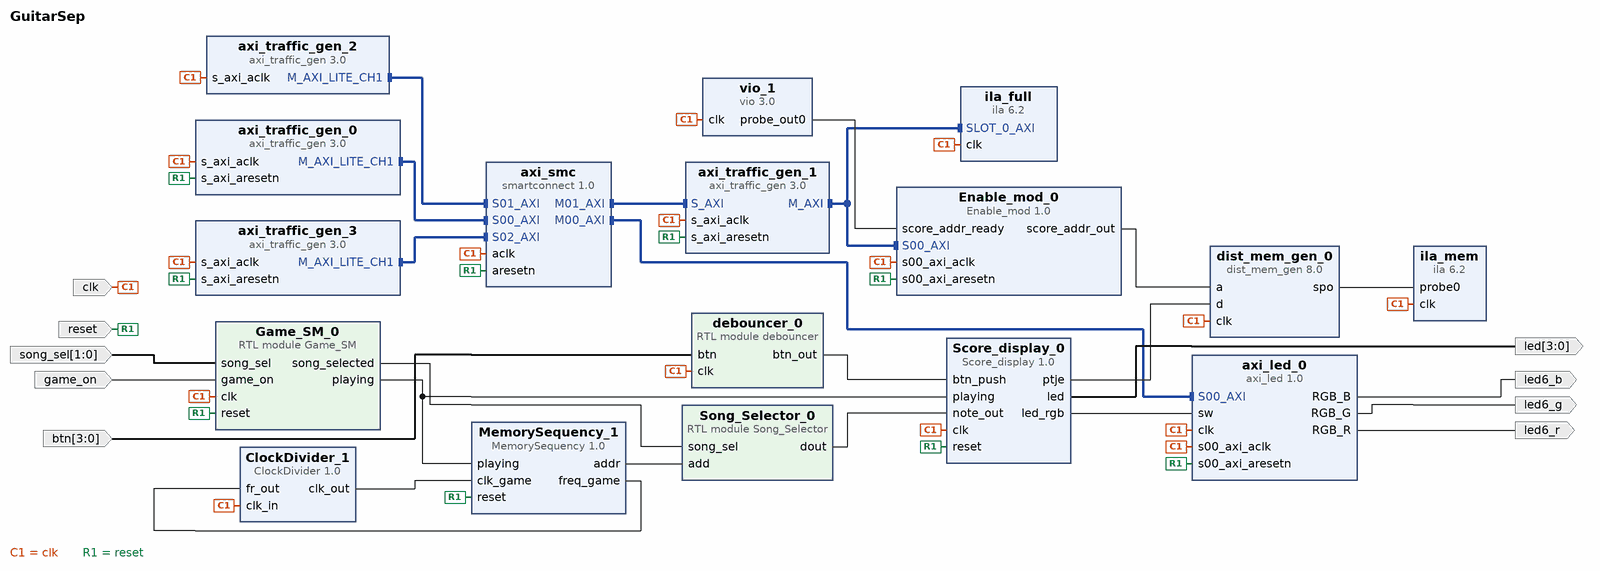
[diagram p0: block diagram of the top level]
# Vivado block design GuitarSep, xc7z010clg400-1, Vivado 2020.1
create_bd_design GuitarSep

create_bd_port -dir I -type clk clk
set_property -dict {CONFIG.ASSOCIATED_RESET reset:reset_0} [get_bd_ports clk]
create_bd_port -dir I -from 3 -to 0 btn
create_bd_port -dir I -from 1 -to 0 song_sel
create_bd_port -dir I -type rst reset
create_bd_port -dir O -from 3 -to 0 led
create_bd_port -dir O led6_b
create_bd_port -dir O led6_g
create_bd_port -dir O led6_r
create_bd_port -dir I game_on

create_bd_cell -type module -reference Game_SM Game_SM_0
create_bd_cell -type module -reference debouncer debouncer_0
create_bd_cell -type ip -vlnv xilinx.com:user:MemorySequency:1.0 MemorySequency_1
create_bd_cell -type ip -vlnv xilinx.com:user:ClockDivider:1.0 ClockDivider_1
create_bd_cell -type ip -vlnv xilinx.com:ip:axi_traffic_gen:3.0 axi_traffic_gen_0
set_property -dict [list \
  CONFIG.C_ATG_MODE AXI4-Lite \
  CONFIG.C_ATG_SYSINIT_MODES System_Test \
  CONFIG.C_ATG_SYSTEM_CMD_MAX_RETRY 2147483647 \
  CONFIG.C_ATG_SYSTEM_INIT_ADDR_MIF ../../../../../../../../../addr.coe \
  CONFIG.C_ATG_SYSTEM_INIT_CTRL_MIF ../../../../../../../../../ctrl.coe \
  CONFIG.C_ATG_SYSTEM_INIT_DATA_MIF ../../../../../../../../../data.coe \
  CONFIG.C_ATG_SYSTEM_INIT_MASK_MIF ../../../../../../../../../mask.coe \
] [get_bd_cells axi_traffic_gen_0]
create_bd_cell -type ip -vlnv xilinx.com:ip:smartconnect:1.0 axi_smc
set_property -dict {CONFIG.NUM_MI 2 CONFIG.NUM_SI 3} [get_bd_cells axi_smc]
create_bd_cell -type ip -vlnv xilinx.com:ip:axi_traffic_gen:3.0 axi_traffic_gen_2
set_property -dict [list \
  CONFIG.C_ATG_MODE AXI4-Lite \
  CONFIG.C_ATG_SYSINIT_MODES System_Test \
  CONFIG.C_ATG_SYSTEM_CMD_MAX_RETRY 2147483647 \
  CONFIG.C_ATG_SYSTEM_INIT_ADDR_MIF {../../../../../../../../../addr - copia.coe} \
  CONFIG.C_ATG_SYSTEM_INIT_CTRL_MIF {../../../../../../../../../ctrl - copia.coe} \
  CONFIG.C_ATG_SYSTEM_INIT_DATA_MIF {../../../../../../../../../data - copia.coe} \
  CONFIG.C_ATG_SYSTEM_INIT_MASK_MIF {../../../../../../../../../mask - copia.coe} \
] [get_bd_cells axi_traffic_gen_2]
create_bd_cell -type ip -vlnv xilinx.com:ip:axi_traffic_gen:3.0 axi_traffic_gen_1
set_property -dict {CONFIG.C_ATG_MODE AXI4} [get_bd_cells axi_traffic_gen_1]
create_bd_cell -type module -reference Song_Selector Song_Selector_0
create_bd_cell -type ip -vlnv xilinx.com:ip:dist_mem_gen:8.0 dist_mem_gen_0
set_property -dict {CONFIG.data_width 4 CONFIG.depth 256 CONFIG.output_options non_registered} [get_bd_cells dist_mem_gen_0]
create_bd_cell -type ip -vlnv xilinx.com:user:Score_display:1.0 Score_display_0
create_bd_cell -type ip -vlnv xilinx.com:user:Enable_mod:1.0 Enable_mod_0
create_bd_cell -type ip -vlnv xilinx.com:ip:axi_traffic_gen:3.0 axi_traffic_gen_3
set_property -dict [list \
  CONFIG.C_ATG_MODE AXI4-Lite \
  CONFIG.C_ATG_SYSINIT_MODES System_Test \
  CONFIG.C_ATG_SYSTEM_CMD_MAX_RETRY 2147483647 \
  CONFIG.C_ATG_SYSTEM_INIT_ADDR_MIF {../../../../../../../../../addr - copia.coe} \
  CONFIG.C_ATG_SYSTEM_INIT_CTRL_MIF {../../../../../../../../../ctrl - copia.coe} \
  CONFIG.C_ATG_SYSTEM_INIT_DATA_MIF {../../../../../../../../../data - copia.coe} \
  CONFIG.C_ATG_SYSTEM_INIT_MASK_MIF ../../../../../../../../../mask.coe \
] [get_bd_cells axi_traffic_gen_3]
create_bd_cell -type ip -vlnv xilinx.com:ip:ila:6.2 ila_mem
set_property -dict [list \
  CONFIG.C_ENABLE_ILA_AXI_MON false \
  CONFIG.C_MONITOR_TYPE Native \
  CONFIG.C_NUM_OF_PROBES 1 \
] [get_bd_cells ila_mem]
create_bd_cell -type ip -vlnv xilinx.com:ip:ila:6.2 ila_full
create_bd_cell -type ip -vlnv xilinx.com:ip:vio:3.0 vio_1
set_property -dict {CONFIG.C_NUM_PROBE_IN 0 CONFIG.C_PROBE_OUT0_INIT_VAL 0x1} [get_bd_cells vio_1]
create_bd_cell -type ip -vlnv xilinx.com:user:axi_led:1.0 axi_led_0

# ---- connections ----

connect_bd_intf_net [get_bd_intf_pins axi_smc/M00_AXI] [get_bd_intf_pins axi_led_0/S00_AXI]
connect_bd_intf_net [get_bd_intf_pins axi_traffic_gen_2/M_AXI_LITE_CH1] [get_bd_intf_pins axi_smc/S01_AXI]
connect_bd_intf_net [get_bd_intf_pins axi_traffic_gen_0/M_AXI_LITE_CH1] [get_bd_intf_pins axi_smc/S00_AXI]
connect_bd_intf_net [get_bd_intf_pins Enable_mod_0/S00_AXI] [get_bd_intf_pins axi_traffic_gen_1/M_AXI]
connect_bd_intf_net [get_bd_intf_pins Enable_mod_0/S00_AXI] [get_bd_intf_pins ila_full/SLOT_0_AXI]
connect_bd_intf_net [get_bd_intf_pins axi_smc/M01_AXI] [get_bd_intf_pins axi_traffic_gen_1/S_AXI]
connect_bd_intf_net [get_bd_intf_pins axi_traffic_gen_3/M_AXI_LITE_CH1] [get_bd_intf_pins axi_smc/S02_AXI]
connect_bd_net -net btn_0_1 [get_bd_ports btn] [get_bd_pins debouncer_0/btn]
connect_bd_net [get_bd_pins Game_SM_0/playing] [get_bd_pins MemorySequency_1/playing] [get_bd_pins Score_display_0/playing]
connect_bd_net -net song_sel_0_1 [get_bd_ports song_sel] [get_bd_pins Game_SM_0/song_sel]
connect_bd_net [get_bd_pins Song_Selector_0/dout] [get_bd_pins Score_display_0/note_out]
connect_bd_net [get_bd_pins MemorySequency_1/freq_game] [get_bd_pins ClockDivider_1/fr_out]
connect_bd_net [get_bd_pins ClockDivider_1/clk_out] [get_bd_pins MemorySequency_1/clk_game]
connect_bd_net [get_bd_pins debouncer_0/btn_out] [get_bd_pins Score_display_0/btn_push]
connect_bd_net [get_bd_ports clk] \
  [get_bd_pins axi_traffic_gen_0/s_axi_aclk] [get_bd_pins axi_smc/aclk] [get_bd_pins debouncer_0/clk] \
  [get_bd_pins Game_SM_0/clk] [get_bd_pins axi_traffic_gen_2/s_axi_aclk] [get_bd_pins ClockDivider_1/clk_in] \
  [get_bd_pins Score_display_0/clk] [get_bd_pins dist_mem_gen_0/clk] [get_bd_pins axi_traffic_gen_1/s_axi_aclk] \
  [get_bd_pins Enable_mod_0/s00_axi_aclk] [get_bd_pins axi_traffic_gen_3/s_axi_aclk] [get_bd_pins ila_mem/clk] \
  [get_bd_pins ila_full/clk] [get_bd_pins vio_1/clk] [get_bd_pins axi_led_0/clk] [get_bd_pins axi_led_0/s00_axi_aclk]
connect_bd_net [get_bd_pins Score_display_0/led_rgb] [get_bd_pins axi_led_0/sw]
connect_bd_net [get_bd_pins Score_display_0/led] [get_bd_ports led]
connect_bd_net [get_bd_pins axi_led_0/RGB_B] [get_bd_ports led6_b]
connect_bd_net [get_bd_pins axi_led_0/RGB_G] [get_bd_ports led6_g]
connect_bd_net [get_bd_pins axi_led_0/RGB_R] [get_bd_ports led6_r]
connect_bd_net [get_bd_pins MemorySequency_1/addr] [get_bd_pins Song_Selector_0/add]
connect_bd_net [get_bd_pins Game_SM_0/song_selected] [get_bd_pins Song_Selector_0/song_sel]
connect_bd_net [get_bd_pins Score_display_0/ptje] [get_bd_pins dist_mem_gen_0/d]
connect_bd_net [get_bd_pins Enable_mod_0/score_addr_out] [get_bd_pins dist_mem_gen_0/a]
connect_bd_net [get_bd_ports reset] \
  [get_bd_pins axi_traffic_gen_1/s_axi_aresetn] [get_bd_pins Enable_mod_0/s00_axi_aresetn] \
  [get_bd_pins axi_traffic_gen_3/s_axi_aresetn] [get_bd_pins Game_SM_0/reset] [get_bd_pins Score_display_0/reset] \
  [get_bd_pins axi_traffic_gen_0/s_axi_aresetn] [get_bd_pins axi_smc/aresetn] [get_bd_pins MemorySequency_1/reset] \
  [get_bd_pins axi_led_0/s00_axi_aresetn]
connect_bd_net [get_bd_pins dist_mem_gen_0/spo] [get_bd_pins ila_mem/probe0]
connect_bd_net [get_bd_pins vio_1/probe_out0] [get_bd_pins Enable_mod_0/score_addr_ready]
connect_bd_net -net game_on_0_1 [get_bd_ports game_on] [get_bd_pins Game_SM_0/game_on]

# ---- address map ----
assign_bd_address -offset 0x44A00000 -range 64K -target_address_space [get_bd_addr_spaces axi_traffic_gen_0/Reg1] [get_bd_addr_segs axi_traffic_gen_1/S_AXI/Reg0]
assign_bd_address -offset 0x76000000 -range 64K -target_address_space [get_bd_addr_spaces axi_traffic_gen_0/Reg1] [get_bd_addr_segs axi_led_0/S00_AXI/S00_AXI_mem]
assign_bd_address -offset 0x76000000 -range 64K -target_address_space [get_bd_addr_spaces axi_traffic_gen_1/Data] [get_bd_addr_segs Enable_mod_0/S00_AXI/S00_AXI_mem]
assign_bd_address -offset 0x44A00000 -range 64K -target_address_space [get_bd_addr_spaces axi_traffic_gen_2/Reg1] [get_bd_addr_segs axi_traffic_gen_1/S_AXI/Reg0]
assign_bd_address -offset 0x76000000 -range 64K -target_address_space [get_bd_addr_spaces axi_traffic_gen_2/Reg1] [get_bd_addr_segs axi_led_0/S00_AXI/S00_AXI_mem]
assign_bd_address -offset 0x44A00000 -range 64K -target_address_space [get_bd_addr_spaces axi_traffic_gen_3/Reg1] [get_bd_addr_segs axi_traffic_gen_1/S_AXI/Reg0]
assign_bd_address -offset 0x76000000 -range 64K -target_address_space [get_bd_addr_spaces axi_traffic_gen_3/Reg1] [get_bd_addr_segs axi_led_0/S00_AXI/S00_AXI_mem]

validate_bd_design
save_bd_design
